# Altium schematic sheet Power.SchDoc
size A4
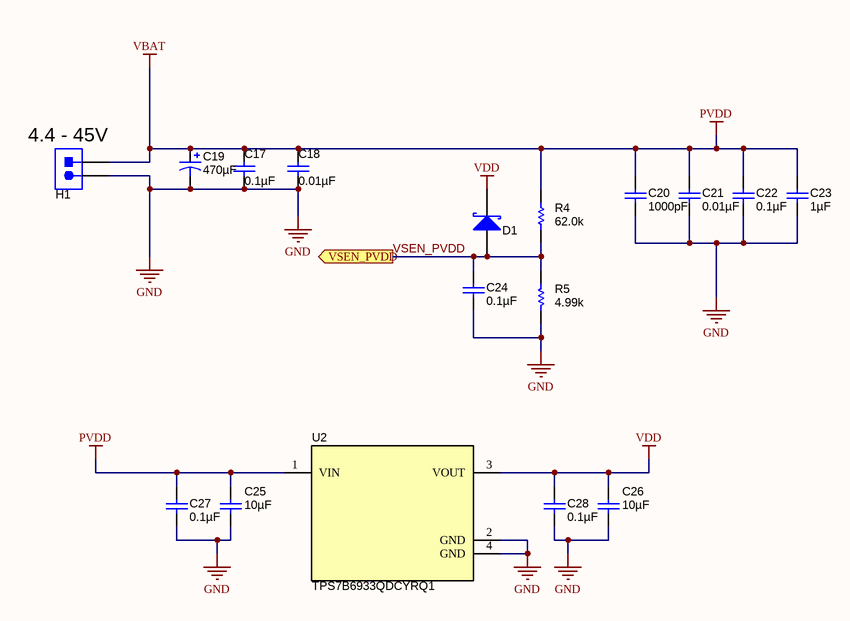
[diagram p0: Power.SchDoc]

## Parts
C17  ValueDisplayed: 0.1µF  [0603L]  (hidden comment: C1608X7R1H104K)
C18  ValueDisplayed: 0.01µF  [0603L]  (hidden comment: C1608X7R1H103K)
C19  ValueDisplayed: 470µF  [M_1000x2000]  (hidden comment: ECA-1HM471)
C20  ValueDisplayed: 1000pF  [0603L]  (hidden comment: C1608X7R1H102K)
C21  ValueDisplayed: 0.01µF  [0603L]  (hidden comment: C1608X7R1H103K)
C22  ValueDisplayed: 0.1µF  [0603L]  (hidden comment: C1608X7R1H104K)
C23  ValueDisplayed: 1µF  [0805L]  (hidden comment: GRM21BR71H105KA12L)
C24  ValueDisplayed: 0.1µF  [0603L]  (hidden comment: C0603C104J4RACTU)
C25  ValueDisplayed: 10µF  [1210L]  (hidden comment: GRM32ER71H106KA12L)
C26  ValueDisplayed: 10µF  [1210L]  (hidden comment: GRM32ER71H106KA12L)
C27  ValueDisplayed: 0.1µF  [0603L]  (hidden comment: C1608X7R1H104K)
C28  ValueDisplayed: 0.1µF  [0603L]  (hidden comment: C1608X7R1H104K)
D1  CD0603-B0130L  [Diode_0603]  (value not drawn)
H1  OSTT7022150  [TERM_BLK_OSTT7022150]  (value not drawn)
R4  value 62.0k  [0603L]  (hidden comment: RC0603FR-0762KL)
R5  value 4.99k  [0603L]  (hidden comment: CRCW06034K99FKEA)
U2  TPS7B6933QDCYRQ1  [DCY0004A_N]

## Ports
VSEN_PVDD (out)

## Nets
GND: C17.2 C18.2 C19.2(-) C20.2 C21.2 C22.2 C23.2 C24.2 C25.2 C26.2 C27.2 C28.2 H1.2 R5.1 U2.2(GND) U2.4(GND)
PVDD: C17.1 C18.1 C19.1(+) C20.1 C21.1 C22.1 C23.1 C25.1 C27.1 H1.1 R4.2 U2.1(VIN)  [also labelled VBAT]
VDD: C26.1 C28.1 D1.1(K) U2.3(VOUT)
VSEN_PVDD: C24.1 D1.2(A) R4.1 R5.2 ; port VSEN_PVDD

## Notes on the sheet
- (near H1) 4.4 - 45V

## Library data of the parts
C17 C22 C27 C28 = C1608X7R1H104K: CAP, CERM, 0.1 µF, 50 V, +/- 10%, X7R, 0603; Manufacturer: TDK; Polarized: N; CompType: Capacitor; Value: 0.1uF; U/M: EA; Cap_F: 0.0000001; Tolerance_%: 10; ESR_ohm: 0.017; Value1: 0.017 ohm; VDC_V: 50; Value2: 50V; TaMin_C: -55; TaMax_C: 125; Cap_Case: 0603; AEC Category: Q200; SymbolVersion: 2008-07-09; PartNumber: C1608X7R1H104K; PackageReference: 0603; RoHS: Y; MountType: SMT; Technology: Ceramic; TempCo: X7R; Published: 2008-06-19; Publisher: Texas Instruments; LatestRevisionDate: 2015-12-04; ComponentLink1Description: Datasheet link; ComponentLink1URL: http://www.tdk.co.jp/tefe02/e412_c.pdf; Supplier 1: Digi-Key; Supplier Part Number 1: 445-1314-1-ND; Supplier 2: Farnell; Supplier Part Number 2: 1118182; AEC Qualified: ?
C18 C21 = C1608X7R1H103K: CAP, CERM, 0.01 µF, 50 V, +/- 10%, X7R, 0603; Manufacturer: TDK; Polarized: N; CompType: Capacitor; Value: 0.01uF; U/M: EA; Cap_F: 0.00000001; Tolerance_%: 10; ESR_ohm: 0.0539; Value1: 0.0539 ohm; VDC_V: 50; Value2: 50V; TaMin_C: -55; TaMax_C: 125; Cap_Case: 0603; AEC Category: Q200; SymbolVersion: 2008-07-09; PartNumber: C1608X7R1H103K; PackageReference: 0603; RoHS: Y; MountType: SMT; Technology: Ceramic; TempCo: X7R; Published: 2008-06-19; Publisher: Texas Instruments; LatestRevisionDate: 2015-12-04; ComponentLink1Description: Datasheet link; ComponentLink1URL: http://www.tdk.co.jp/tefe02/e412_c.pdf; Supplier 1: Digi-Key; Supplier Part Number 1: 445-1311-1-ND; Supplier 2: Farnell; Supplier Part Number 2: 1907315; AEC Qualified: ?
C19 = ECA-1HM471: CAP, AL, 470 µF, 50 V, +/- 20%, TH; Manufacturer: Panasonic; Polarized: Y; CompType: Capacitor; Value: 470uF; U/M: EA; Cap_F: 0.00047; Tolerance_%: 20; Value1: Unknown; VDC_V: 50; Value2: 50V; IRMS_A: 0.65; TaMin_C: -40; TaMax_C: 85; Cap_Case: 10x20mm; AEC Category: Q200; SymbolVersion: 2008-07-09; PartNumber: ECA-1HM471; PackageReference: 10x20; RoHS: Y; MountType: TH; Technology: AL; Series: M; Publisher: Texas Instruments; LatestRevisionDate: 2015-12-17; ComponentLink1Description: Datasheet link; ComponentLink1URL: http://industrial.panasonic.com/www-data/pdf/ABA0000/ABA0000CE12.pdf; Supplier 1: Digi-Key; Supplier Part Number 1: P5185-ND; Supplier 2: Mouser; Supplier Part Number 2: 667-ECA-1HM471; Supplier 3: Farnell; Supplier Part Number 3: 9693815; AEC Qualified: ?
C20 = C1608X7R1H102K: CAP, CERM, 1000 pF, 50 V, +/- 10%, X7R, 0603; Manufacturer: TDK; Polarized: N; CompType: Capacitor; Value: 1000pF; U/M: EA; Cap_F: 0.000000001; Tolerance_%: 10; ESR_ohm: 0.24; Value1: 0.24 ohm; VDC_V: 50; Value2: 50V; TaMin_C: -55; TaMax_C: 125; Cap_Case: 0603; AEC Category: Q200; SymbolVersion: 2008-07-09; PartNumber: C1608X7R1H102K; PackageReference: 0603; RoHS: Y; MountType: SMT; Technology: Ceramic; TempCo: X7R; Published: 2008-06-19; Publisher: Texas Instruments; LatestRevisionDate: 2015-12-04; ComponentLink1Description: Datasheet link; ComponentLink1URL: http://www.tdk.co.jp/tefe02/e412_c.pdf; Supplier 1: Digi-Key; Supplier Part Number 1: 445-1308-1-ND; Supplier 2: Farnell; Supplier Part Number 2: 1844239; AEC Qualified: ?
C23 = GRM21BR71H105KA12L: CAP, CERM, 1 µF, 50 V, +/- 10%, X7R, 0805; Manufacturer: MuRata; Polarized: N; CompType: Capacitor; Value: 1uF; U/M: EA; Cap_F: 0.000001; Tolerance_%: 10; Value1: Unknown; VDC_V: 50; Value2: 50V; TaMin_C: -55; TaMax_C: 125; Cap_Case: 0805; AEC Category: Q200; SymbolVersion: 2008-07-09; PartNumber: GRM21BR71H105KA12L; PackageReference: 0805; RoHS: Y; MountType: SMT; Technology: Ceramic; TempCo: X7R; Published: 2008-06-19; Publisher: Texas Instruments; LatestRevisionDate: 2015-12-04; ComponentLink1Description: Datasheet link; ComponentLink1URL: http://search.murata.co.jp/Ceramy/PnsearchViewAction.do?HnOFG=ON&HnNFG=ON&SEL_CNT=50&sLang=en&sKey=GRM21BR71H105KA12L&x=9&y=9&search=startwith; Supplier 1: Digi-Key; Supplier Part Number 1: 490-4736-1-ND; Supplier 2: Mouser; Supplier Part Number 2: 81-GRM21BR71H105KA2L; Supplier 3: Farnell; Supplier Part Number 3: 1735541; AEC Qualified: ?
C24 = C0603C104J4RACTU: CAP, CERM, 0.1 µF, 16 V, +/- 5%, X7R, 0603; Manufacturer: Kemet; Polarized: N; CompType: Capacitor; Value: 0.1uF; U/M: EA; Cap_F: 0.0000001; Tolerance_%: 5; Value1: Unknown; VDC_V: 16; Value2: 16V; TaMin_C: -55; TaMax_C: 125; Cap_Case: 0603; AEC Category: Q200; SymbolVersion: 2008-07-09; PartNumber: C0603C104J4RACTU; PackageReference: 0603; RoHS: Y; MountType: SMT; Technology: Ceramic; TempCo: X7R; Published: 2008-06-19; Publisher: Texas Instruments; LatestRevisionDate: 2015-12-04; ComponentLink1Description: Datasheet link; ComponentLink1URL: http://www.kemet.com/kemet/web/homepage/kechome.nsf/vapubfiles/F3102_Y5V.pdf/$file/F3102_Y5V.pdf; Supplier 1: Digi-Key; Supplier Part Number 1: 399-1097-1-ND; Supplier 2: Mouser; Supplier Part Number 2: 80-C0603C104J4R; Supplier 3: Farnell; Supplier Part Number 3: 1650834; AEC Qualified: ?
C25 C26 = GRM32ER71H106KA12L: CAP, CERM, 10 µF, 50 V, +/- 10%, X7R, 1210; Manufacturer: MuRata; Polarized: N; CompType: Capacitor; Value: 10uF; U/M: EA; Cap_F: 0.00001; Tolerance_%: 10; Value1: Unknown; VDC_V: 50; Value2: 50V; TaMin_C: -55; TaMax_C: 125; Cap_Case: 1210; AEC Category: Q200; SymbolVersion: 2008-07-09; PartNumber: GRM32ER71H106KA12L; PackageReference: 1210; RoHS: Y; MountType: SMT; Technology: Ceramic; TempCo: X7R; Published: 2008-06-19; Publisher: Texas Instruments; LatestRevisionDate: 2015-12-04; ComponentLink1Description: Datasheet link; ComponentLink1URL: http://www.murata.com/products/catalog/pdf/c02e.pdf; Supplier 1: Digi-Key; Supplier Part Number 1: 490-6544-1-ND; Supplier 2: Mouser; Supplier Part Number 2: 81-GRM32ER71H106KA2L; AEC Qualified: ?
D1 = CD0603-B0130L: Diode, Schottky, 35 V, 0.1 A, 0603 Diode; Manufacturer: Bourns; Value: 35V; U/M: EA; Vf_V: 0.44; Value1: 0.1A; Value2: 0.44V; Io_A: 0.1; Vr_V: 35; TJmax_C: 125; AEC Category: Q101; CompType: Diode; SymbolVersion: 2008-12-08; PartNumber: CD0603-B0130L; PackageReference: 0603 Diode; MountType: SMT; Type: Schottky; RoHS: Y; Published: 2008-06-26; Publisher: Texas Instruments; LatestRevisionDate: 2015-11-30; ComponentLink1Description: Datasheet link; ComponentLink1URL: http://www.bourns.com/pdfs/SBCD0603_1005.pdf; Supplier 1: Mouser; Supplier Part Number 1: 652-CD0603-B0130L; Supplier 2: Farnell; Supplier Part Number 2: 7599572; AEC Qualified: ?
H1 = OSTT7022150: Terminal Block, 30A, 9.52mm (.375) Pitch, 2-Pos, TH; Manufacturer: On-Shore Technology; SymbolCreator: a0412235; CompType: Connector; SymbolVersion: 2013-10-31; PartNumber: OSTT7022150; PackageReference: 19.62x21.5x12.5mm; RoHS: Y; MountType: TH; ComponentLink1Description: Datasheet URL; ComponentLink1URL: http://on-shore.com/sites/default/files/manuals/OSTT7XX2150.pdf; Publisher: Texas Instruments; LatestRevisionDate: 2015-12-23; Supplier 1: Digi-Key; Supplier Part Number 1: ED2677-ND
R4 = RC0603FR-0762KL: RES, 62.0 k, 1%, 0.1 W, 0603; Manufacturer: Yageo America; CompType: Resistor; Res_ohm: 62000; Value_Code: 62k0; Tolerance_%: 1; Power_W: 0.1; Value2: 0.1W; VDC_V: 150; TempCo: 200 ppm/C; U/M: EA; AEC Category: Q200; SymbolVersion: 2009-05-29; PartNumber: RC0603FR-0762KL; ValueDisplayed: 62.0k; PackageReference: 0603; RoHS: Y; Value1: 1%; MountType: SMT; Technology: Thick Film; Published: 2008-06-26; Publisher: Texas Instruments; LatestRevisionDate: 2015-11-22; ComponentLink1Description: Datasheet link; ComponentLink1URL: http://www.yageo.com/pdf/Pu-RC0603_51_PbFree_L_2.pdf; Supplier 1: Digi-Key; Supplier Part Number 1: 311-62.0KHRCT-ND; Supplier 2: Mouser; Supplier Part Number 2: 603-RC0603FR-0762KL; AEC Qualified: ?
R5 = CRCW06034K99FKEA: RES, 4.99 k, 1%, 0.1 W, 0603; Manufacturer: Vishay-Dale; CompType: Resistor; Res_ohm: 4990; Value_Code: 4k99; Tolerance_%: 1; Power_W: 0.1; Value2: 0.1W; VDC_V: 75; TempCo: 100 ppm/C; EIA_Code: E96; U/M: EA; AEC Category: Q200; SymbolVersion: 2009-05-29; PartNumber: CRCW06034K99FKEA; PackageReference: 0603; RoHS: Y; Value1: 1%; MountType: SMT; Technology: Thick Film; Published: 2008-06-26; Publisher: Texas Instruments; LatestRevisionDate: 2015-11-22; ComponentLink1Description: Datasheet link; ComponentLink1URL: http://www.vishay.com/docs/20035/dcrcwe3.pdf; Supplier 1: Digi-Key; Supplier Part Number 1: 541-4.99KHCT-ND; Supplier 2: Mouser; Supplier Part Number 2: 71-CRCW0603-4.99K-E3; Supplier 3: Farnell; Supplier Part Number 3: 1652885; ValueDisplayed: 4.99k; AEC Qualified: ?
U2 = TPS7B6933QDCYRQ1: High Voltage Ultra Low Iq - Low Drop Out Regulator, DCY0004A; Manufacturer: Texas Instruments; SymbolCreator: Altium; CompType: IC; U/M: EA; SymbolVersion: 2014-08-05; PartNumber: TPS7B6933QDCYRQ1; PackageReference: DCY0004A; MountType: SMT; ComponentLink1Description: Datasheet Link; ComponentLink1URL: http://www.ti.com/lit/ds/symlink/tps7b6933-q1.pdf; Publisher: Texas Instruments; LatestRevisionDate: 2015-12-29; Alternate Manufacturer: Texas Instruments